# Altium schematic sheet SDRAM.SchDoc
size A4
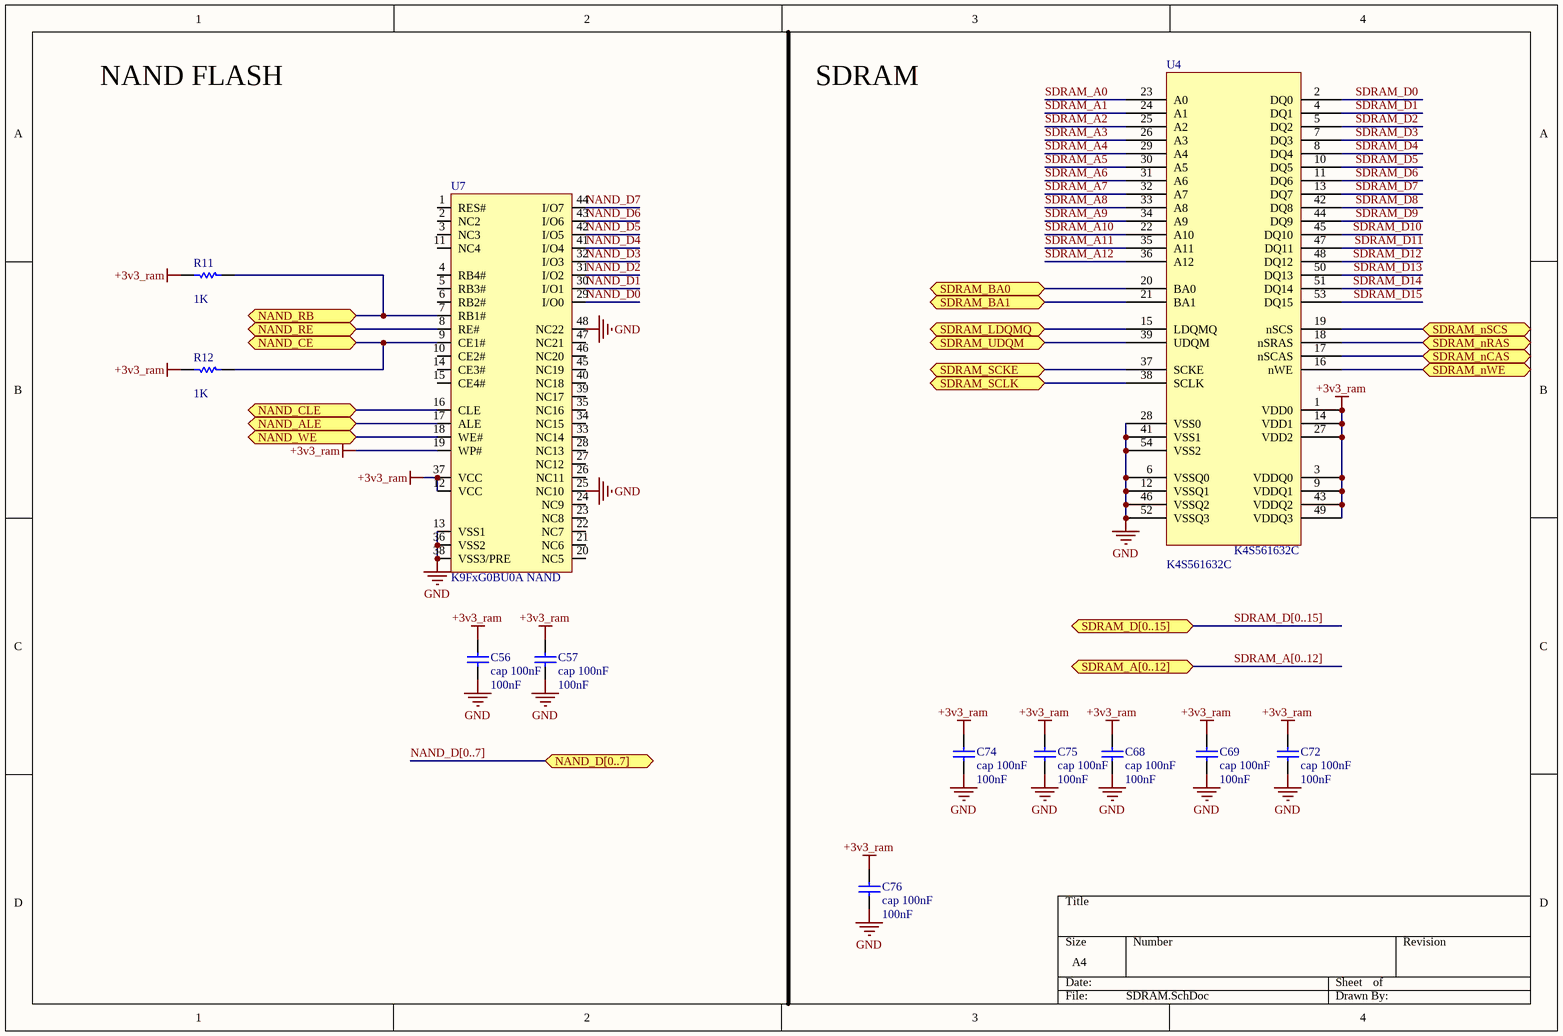
[diagram p0: SDRAM.SchDoc]

## Parts
C56  cap 100nF  value 100nF  [Cap 805]
C57  cap 100nF  value 100nF  [Cap 805]
C68  cap 100nF  value 100nF  [Cap 805]
C69  cap 100nF  value 100nF  [Cap 805]
C72  cap 100nF  value 100nF  [Cap 805]
C74  cap 100nF  value 100nF  [Cap 805]
C75  cap 100nF  value 100nF  [Cap 805]
C76  cap 100nF  value 100nF  [Cap 805]
R11  value 1K  [RES 0805 (2012X06L)]  (hidden comment: Res 1K)
R12  value 1K  [RES 0805 (2012X06L)]  (hidden comment: Res 1K)
U4  K4S561632C  [RAM]
U7  K9FxG0BU0A NAND  [TSOP-48]

## Ports
NAND_ALE (bidir), NAND_CE (bidir), NAND_CLE (bidir), NAND_D[0..7] (bidir), NAND_RB (bidir), NAND_RE (bidir), NAND_WE (bidir), SDRAM_A[0..12] (bidir), SDRAM_BA0 (bidir), SDRAM_BA1 (bidir), SDRAM_D[0..15] (bidir), SDRAM_LDQMQ (bidir), SDRAM_nCAS (bidir), SDRAM_nRAS (bidir), SDRAM_nSCS (bidir), SDRAM_nWE (bidir), SDRAM_SCKE (bidir), SDRAM_SCLK (bidir), SDRAM_UDQM (bidir)

## Nets
+3v3_ram: C56.2 C57.2 C68.2 C69.2 C72.2 C74.2 C75.2 C76.2 R11.2 R12.1 U4.1(VDD0) U4.3(VDDQ0) U4.9(VDDQ1) U4.14(VDD1) U4.27(VDD2) U4.43(VDDQ2) U4.49(VDDQ3) U7.12(VCC) U7.19(WP#) U7.37(VCC)
GND: C56.1 C57.1 C68.1 C69.1 C72.1 C74.1 C75.1 C76.1 U4.6(VSSQ0) U4.12(VSSQ1) U4.28(VSS0) U4.41(VSS1) U4.46(VSSQ2) U4.52(VSSQ3) U4.54(VSS2) U7.13(VSS1) U7.25(NC10) U7.36(VSS2) U7.38(VSS3/PRE) U7.48(NC22)
NAND_ALE: U7.17(ALE) ; port NAND_ALE
NAND_CE: R12.2 U7.9(CE1#) ; port NAND_CE
NAND_CLE: U7.16(CLE) ; port NAND_CLE
NAND_D0: U7.29(I/O0)
NAND_D1: U7.30(I/O1)
NAND_D2: U7.31(I/O2)
NAND_D3: U7.32(I/O3)
NAND_D4: U7.41(I/O4)
NAND_D5: U7.42(I/O5)
NAND_D6: U7.43(I/O6)
NAND_D7: U7.44(I/O7)
NAND_RB: R11.1 U7.7(RB1#) ; port NAND_RB
NAND_RE: U7.8(RE#) ; port NAND_RE
NAND_WE: U7.18(WE#) ; port NAND_WE
SDRAM_A0: U4.23(A0)
SDRAM_A1: U4.24(A1)
SDRAM_A2: U4.25(A2)
SDRAM_A3: U4.26(A3)
SDRAM_A4: U4.29(A4)
SDRAM_A5: U4.30(A5)
SDRAM_A6: U4.31(A6)
SDRAM_A7: U4.32(A7)
SDRAM_A8: U4.33(A8)
SDRAM_A9: U4.34(A9)
SDRAM_A10: U4.22(A10)
SDRAM_A11: U4.35(A11)
SDRAM_A12: U4.36(A12)
SDRAM_BA0: U4.20(BA0) ; port SDRAM_BA0
SDRAM_BA1: U4.21(BA1) ; port SDRAM_BA1
SDRAM_D0: U4.2(DQ0)
SDRAM_D1: U4.4(DQ1)
SDRAM_D2: U4.5(DQ2)
SDRAM_D3: U4.7(DQ3)
SDRAM_D4: U4.8(DQ4)
SDRAM_D5: U4.10(DQ5)
SDRAM_D6: U4.11(DQ6)
SDRAM_D7: U4.13(DQ7)
SDRAM_D8: U4.42(DQ8)
SDRAM_D9: U4.44(DQ9)
SDRAM_D10: U4.45(DQ10)
SDRAM_D11: U4.47(DQ11)
SDRAM_D12: U4.48(DQ12)
SDRAM_D13: U4.50(DQ13)
SDRAM_D14: U4.51(DQ14)
SDRAM_D15: U4.53(DQ15)
SDRAM_LDQMQ: U4.15(LDQMQ) ; port SDRAM_LDQMQ
SDRAM_nCAS: U4.17(nSCAS) ; port SDRAM_nCAS
SDRAM_nRAS: U4.18(nSRAS) ; port SDRAM_nRAS
SDRAM_nSCS: U4.19(nSCS) ; port SDRAM_nSCS
SDRAM_nWE: U4.16(nWE) ; port SDRAM_nWE
SDRAM_SCKE: U4.37(SCKE) ; port SDRAM_SCKE
SDRAM_SCLK: U4.38(SCLK) ; port SDRAM_SCLK
SDRAM_UDQM: U4.39(UDQM) ; port SDRAM_UDQM

Not connected (* = marked no-connect by the designer): U7 1(RES#) 2(NC2) 3(NC3) 4(RB4#) 5(RB3#) 6(RB2#) 10(CE2#) 11(NC4) 14(CE3#) 15(CE4#) 20(NC5) 21(NC6) 22(NC7) 23(NC8) 24(NC9) 26(NC11) 27(NC12) 28(NC13) 33(NC14) 34(NC15) 35(NC16) 39(NC17) 40(NC18) 45(NC19) 46(NC20) 47(NC21)

## Buses and harness runs
bus NAND_D[0..7] = port NAND_D[0..7]
bus SDRAM_A[0..12] = port SDRAM_A[0..12]
bus SDRAM_D[0..15] = port SDRAM_D[0..15]

## Notes on the sheet
- NAND FLASH
- SDRAM

## Library data of the parts
C56 C57 C68 C69 C72 C74-C76 = Cap: Capacitor; Published: 8-Jun-2000; LatestRevisionDate: 17-Jul-2002; LatestRevisionNote: Re-released for DXP Platform.; PackageReference: RAD-0.3; Publisher: Altium Limited; PackageDescription: Radial Cap, Thru-Hole; 2 Leads; 0.3 in Pin Spacing
R11 R12 = Res1: Resistor; Published: 8-Jun-2000; LatestRevisionDate: 17-Jul-2002; LatestRevisionNote: Re-released for DXP Platform.; PackageReference: AXIAL-0.3; Publisher: Altium Limited; PackageDescription: Axial Device, Thru-Hole; 2 Leads; 0.3 in Pin Spacing
U4 = K4S561632C: MT48LC16M16A2P or K4S561632C SDram
U7 = K9FxG0BU0A NAND: Nand Flash